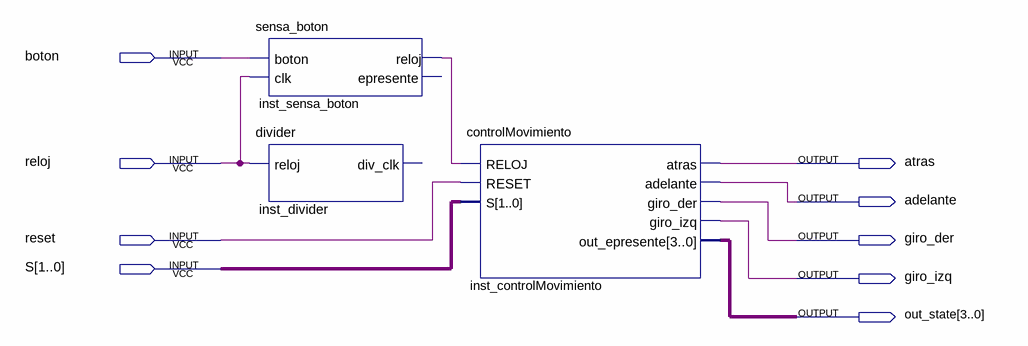
[diagram p0: schematic sheet]
// Quartus schematic practica2.bdf as structural Verilog: 3 symbols, 9 pins
module practica2 (
  input  boton,
  input  reloj,
  input  reset,
  input  [1:0] S,
  output atras,
  output adelante,
  output giro_der,
  output giro_izq,
  output [3:0] out_state
);

  wire inst_sensa_boton_reloj;

  sensa_boton inst_sensa_boton (.boton(boton), .clk(reloj), .reloj(inst_sensa_boton_reloj));  // open: epresente
  divider inst_divider (.reloj(reloj));  // open: div_clk
  controlMovimiento inst_controlMovimiento (
    .RELOJ(inst_sensa_boton_reloj), .RESET(reset), .S(S), .atras(atras), .adelante(adelante),
    .giro_der(giro_der), .giro_izq(giro_izq), .out_epresente(out_state));
endmodule
